# Altium schematic sheet Sheet1.SchDoc
size A4; SheetNumber: 1; SheetTotal: 1
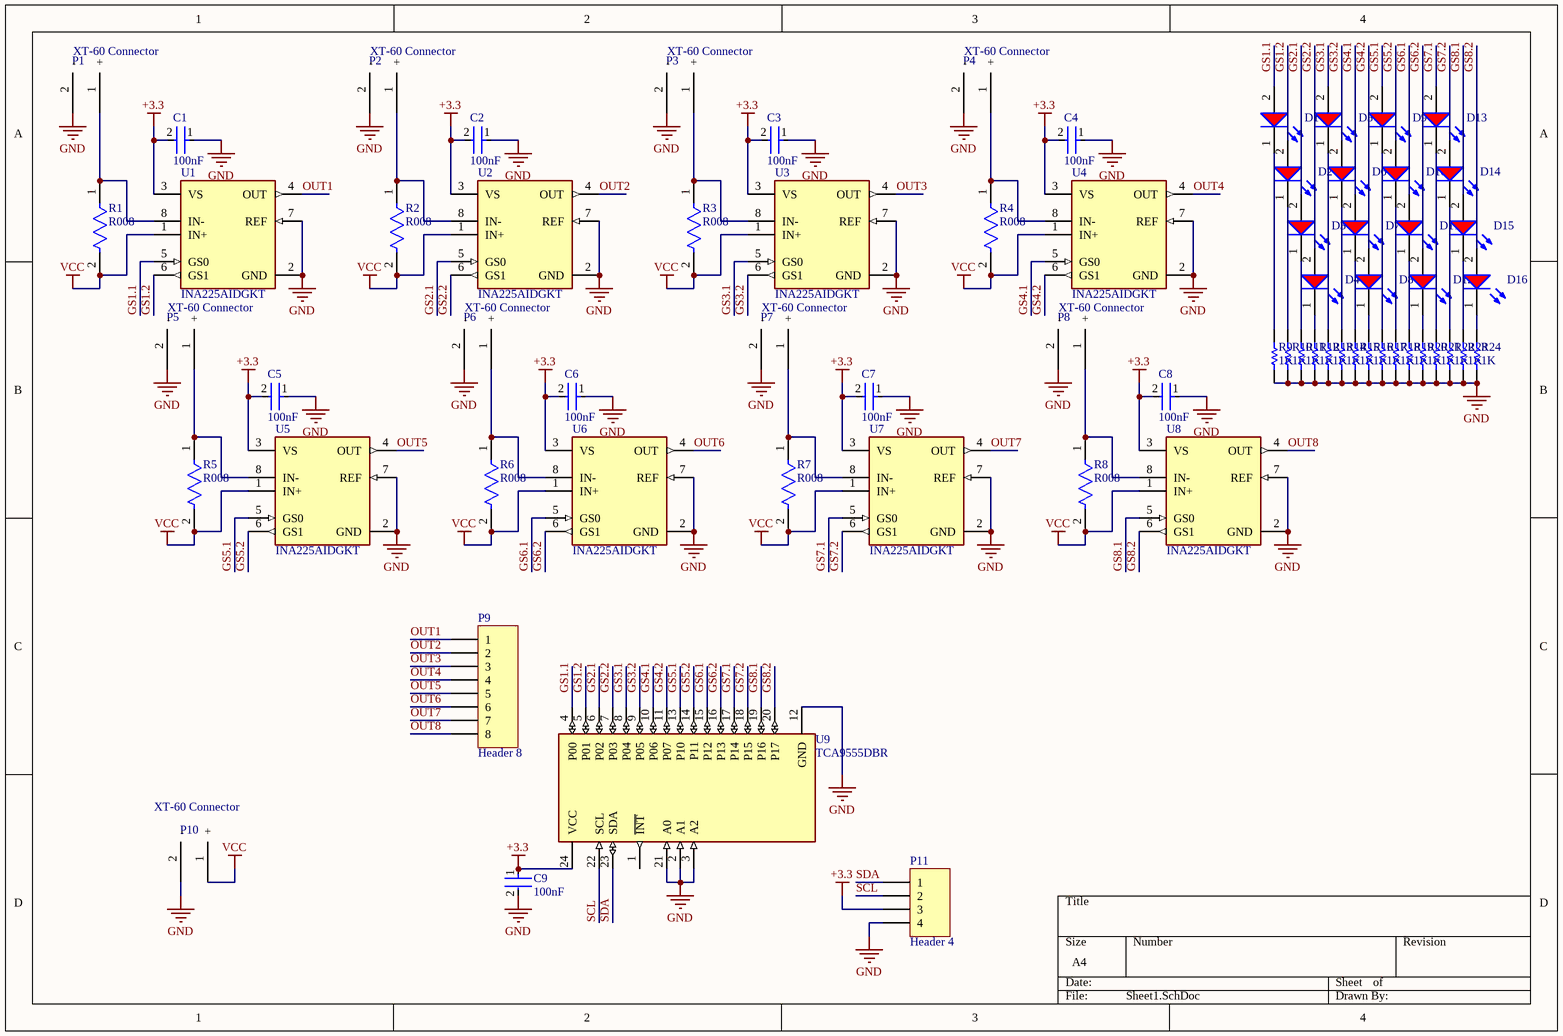
[diagram p0: Sheet1.SchDoc]

## Parts
C1  100nF  [FP-0805-L_2_01_0_2-W_1_25-IPC_B]
C2  100nF  [FP-0805-L_2_01_0_2-W_1_25-IPC_B]
C3  100nF  [FP-0805-L_2_01_0_2-W_1_25-IPC_B]
C4  100nF  [FP-0805-L_2_01_0_2-W_1_25-IPC_B]
C5  100nF  [FP-0805-L_2_01_0_2-W_1_25-IPC_B]
C6  100nF  [FP-0805-L_2_01_0_2-W_1_25-IPC_B]
C7  100nF  [FP-0805-L_2_01_0_2-W_1_25-IPC_B]
C8  100nF  [FP-0805-L_2_01_0_2-W_1_25-IPC_B]
C9  100nF  [FP-0805-L_2_01_0_2-W_1_25-IPC_B]
D1  150080SS75000  [WL-SMCW_0805_150080xx75000]  (value not drawn)
D2  150080SS75000  [WL-SMCW_0805_150080xx75000]  (value not drawn)
D3  150080SS75000  [WL-SMCW_0805_150080xx75000]  (value not drawn)
D4  150080SS75000  [WL-SMCW_0805_150080xx75000]  (value not drawn)
D5  150080SS75000  [WL-SMCW_0805_150080xx75000]  (value not drawn)
D6  150080SS75000  [WL-SMCW_0805_150080xx75000]  (value not drawn)
D7  150080SS75000  [WL-SMCW_0805_150080xx75000]  (value not drawn)
D8  150080SS75000  [WL-SMCW_0805_150080xx75000]  (value not drawn)
D9  150080SS75000  [WL-SMCW_0805_150080xx75000]  (value not drawn)
D10  150080SS75000  [WL-SMCW_0805_150080xx75000]  (value not drawn)
D11  150080SS75000  [WL-SMCW_0805_150080xx75000]  (value not drawn)
D12  150080SS75000  [WL-SMCW_0805_150080xx75000]  (value not drawn)
D13  150080SS75000  [WL-SMCW_0805_150080xx75000]  (value not drawn)
D14  150080SS75000  [WL-SMCW_0805_150080xx75000]  (value not drawn)
D15  150080SS75000  [WL-SMCW_0805_150080xx75000]  (value not drawn)
D16  150080SS75000  [WL-SMCW_0805_150080xx75000]  (value not drawn)
P1  XT-60 Connector  [2]
P2  XT-60 Connector  [2]
P3  XT-60 Connector  [2]
P4  XT-60 Connector  [2]
P5  XT-60 Connector  [2]
P6  XT-60 Connector  [2]
P7  XT-60 Connector  [2]
P8  XT-60 Connector  [2]
P9  Header 8  [HDR1X8]
P10  XT-60 Connector  [2]
P11  Header 4  [HDR1X4]
R1  R008  [FP-RL2512-MFG]
R2  R008  [FP-RL2512-MFG]
R3  R008  [FP-RL2512-MFG]
R4  R008  [FP-RL2512-MFG]
R5  R008  [FP-RL2512-MFG]
R6  R008  [FP-RL2512-MFG]
R7  R008  [FP-RL2512-MFG]
R8  R008  [FP-RL2512-MFG]
R9  1K  [RESC2013X60X35ML10T20]
R10  1K  [RESC2013X60X35ML10T20]
R11  1K  [RESC2013X60X35ML10T20]
R12  1K  [RESC2013X60X35ML10T20]
R13  1K  [RESC2013X60X35ML10T20]
R14  1K  [RESC2013X60X35ML10T20]
R15  1K  [RESC2013X60X35ML10T20]
R16  1K  [RESC2013X60X35ML10T20]
R17  1K  [RESC2013X60X35ML10T20]
R18  1K  [RESC2013X60X35ML10T20]
R19  1K  [RESC2013X60X35ML10T20]
R20  1K  [RESC2013X60X35ML10T20]
R21  1K  [RESC2013X60X35ML10T20]
R22  1K  [RESC2013X60X35ML10T20]
R23  1K  [RESC2013X60X35ML10T20]
R24  1K  [RESC2013X60X35ML10T20]
U1  INA225AIDGKT  [FP-INA225AIDGKT-IPC_A]
U2  INA225AIDGKT  [FP-INA225AIDGKT-IPC_A]
U3  INA225AIDGKT  [FP-INA225AIDGKT-IPC_A]
U4  INA225AIDGKT  [FP-INA225AIDGKT-IPC_A]
U5  INA225AIDGKT  [FP-INA225AIDGKT-IPC_A]
U6  INA225AIDGKT  [FP-INA225AIDGKT-IPC_A]
U7  INA225AIDGKT  [FP-INA225AIDGKT-IPC_A]
U8  INA225AIDGKT  [FP-INA225AIDGKT-IPC_A]
U9  TCA9555DBR  [FP-DB0024A-IPC_A]

## Nets
+3.3: C1.2 C2.2 C3.2 C4.2 C5.2 C6.2 C7.2 C8.2 C9.1 P11.3 U1.3(VS) U2.3(VS) U3.3(VS) U4.3(VS) U5.3(VS) U6.3(VS) U7.3(VS) U8.3(VS) U9.24(VCC)
GND: C1.1 C2.1 C3.1 C4.1 C5.1 C6.1 C7.1 C8.1 C9.2 P1.2(-) P2.2(-) P3.2(-) P4.2(-) P5.2(-) P6.2(-) P7.2(-) P8.2(-) P10.2(-) P11.4 R9.1 R10.1 R11.1 R12.1 R13.1 R14.1 R15.1 R16.1 R17.1 R18.1 R19.1 R20.1 R21.1 R22.1 R23.1 R24.1 U1.2(GND) U1.7(REF) U2.2(GND) U2.7(REF) U3.2(GND) U3.7(REF) U4.2(GND) U4.7(REF) U5.2(GND) U5.7(REF) U6.2(GND) U6.7(REF) U7.2(GND) U7.7(REF) U8.2(GND) U8.7(REF) U9.2(A1) U9.3(A2) U9.12(GND) U9.21(A0)
VCC: P10.1(+) R1.2 R2.2 R3.2 R4.2 R5.2 R6.2 R7.2 R8.2 U1.1(IN+) U2.1(IN+) U3.1(IN+) U4.1(IN+) U5.1(IN+) U6.1(IN+) U7.1(IN+) U8.1(IN+)
GS1.1: D1.2(A) U1.5(GS0) U9.4(P00)
GS1.2: D2.2(A) U1.6(GS1) U9.5(P01)
GS2.1: D3.2(A) U2.5(GS0) U9.6(P02)
GS2.2: D4.2(A) U2.6(GS1) U9.7(P03)
GS3.1: D5.2(A) U3.5(GS0) U9.8(P04)
GS3.2: D6.2(A) U3.6(GS1) U9.9(P05)
GS4.1: D7.2(A) U4.5(GS0) U9.10(P06)
GS4.2: D8.2(A) U4.6(GS1) U9.11(P07)
GS5.1: D9.2(A) U5.5(GS0) U9.13(P10)
GS5.2: D10.2(A) U5.6(GS1) U9.14(P11)
GS6.1: D11.2(A) U6.5(GS0) U9.15(P12)
GS6.2: D12.2(A) U6.6(GS1) U9.16(P13)
GS7.1: D13.2(A) U7.5(GS0) U9.17(P14)
GS7.2: D14.2(A) U7.6(GS1) U9.18(P15)
GS8.1: D15.2(A) U8.5(GS0) U9.19(P16)
GS8.2: D16.2(A) U8.6(GS1) U9.20(P17)
OUT1: P9.1 U1.4(OUT)
OUT2: P9.2 U2.4(OUT)
OUT3: P9.3 U3.4(OUT)
OUT4: P9.4 U4.4(OUT)
OUT5: P9.5 U5.4(OUT)
OUT6: P9.6 U6.4(OUT)
OUT7: P9.7 U7.4(OUT)
OUT8: P9.8 U8.4(OUT)
SCL: P11.2 U9.22(SCL)
SDA: P11.1 U9.23(SDA)
NetD1_1: D1.1(K) R9.2
NetD2_1: D2.1(K) R10.2
NetD3_1: D3.1(K) R11.2
NetD4_1: D4.1(K) R12.2
NetD5_1: D5.1(K) R13.2
NetD6_1: D6.1(K) R14.2
NetD7_1: D7.1(K) R15.2
NetD8_1: D8.1(K) R16.2
NetD9_1: D9.1(K) R17.2
NetD10_1: D10.1(K) R18.2
NetD11_1: D11.1(K) R19.2
NetD12_1: D12.1(K) R20.2
NetD13_1: D13.1(K) R21.2
NetD14_1: D14.1(K) R22.2
NetD15_1: D15.1(K) R23.2
NetD16_1: D16.1(K) R24.2
NetP1_1: P1.1(+) R1.1 U1.8(IN-)
NetP2_1: P2.1(+) R2.1 U2.8(IN-)
NetP3_1: P3.1(+) R3.1 U3.8(IN-)
NetP4_1: P4.1(+) R4.1 U4.8(IN-)
NetP5_1: P5.1(+) R5.1 U5.8(IN-)
NetP6_1: P6.1(+) R6.1 U6.8(IN-)
NetP7_1: P7.1(+) R7.1 U7.8(IN-)
NetP8_1: P8.1(+) R8.1 U8.8(IN-)

Not connected (* = marked no-connect by the designer): U9 1(~{INT})

## Library data of the parts
C1-C9 = CMP-2007-04174-2: General Purpose Ceramic Capacitor, 0805, 100nF, 10%, X7R, 15%, 100V; Packaging: Tape and Reel; Min Operating Temperature: -55°C; Dielectric Material: Ceramic; Height: 1.4mm; Voltage Rating: 100V; Termination: SMD/SMT; Case Code (Imperial): 0805; Case Code (Metric): 2012; Case/Package: 0805; Construction: Flat; Radiation Hardening: No; Series: -; Dielectric: X7R; Package Quantity: 2000; Mount: Surface Mount; Capacitance: 100nF; Contact Plating: Tin; Voltage: 100V; Lead Free: Lead Free; Depth: 1.25mm; RoHS Compliant: Yes; Number of Pins: 2; Max Operating Temperature: 125°C; Length: 2.01mm; Voltage Rating (DC): 100V; Thickness: 0.055inch; REACH SVHC: No SVHC; Width: 0.049inch; Tolerance: 10%
D1-D16 = CMP-1426-00010-3: NexarPartId: 29717782; Peak Wavelength: 645nm; Luminous Intensity: 60mcd; Max Junction Temperature (Tj): 95°C; Wavelength: 630nm; Forward Current: 100mA; Max Reverse Voltage (DC): 5V; Color: Red; Lens Style: Clear, Rectangular; Test Current: 20mA; Power Dissipation: 72mW; Viewing Angle: 140°; Forward Voltage: 1.9V; Case Code (Metric): 2012; Max Operating Temperature: 85°C; Mount: Surface Mount; Height: 700µm; Case/Package: 0805; Min Operating Temperature: -40°C; Reverse Voltage: 5V; RoHS: Compliant; Packaging: Tape and Reel; REACH SVHC: Unknown; Case Code (Imperial): 0805; Length: 2mm; Width: 1.25mm; Dominant Wavelength: 630nm
P1-P8 P10 = XT-60 Connector: Manufacturer: POLOLU; Manufacturer Part Number: XT60 YELLOW; Unit: pcs; SuppliedAmount: 0; MinAmount: 1; Type of robotics accessories: power connector; Maximum current: 65A; Information: Product is not a working device, but only component; Supplier 1: TME; Category: Power Supply Modules; Stock 1: 29; Pricing 1: 1=2.08, 10=1.95 (USD); Weight: 7.267; Multiples: 1; Number of pins: 2; Colour: yellow; Price Type: NET; ComponentLink1URL: http://static.tme.eu/products_pics/8/b/5/8b5040a8a5baf3e0e67386c2e3a9b903/913.jpg; ComponentLink1Description: http://static.tme.eu/products_pics/8/b/5/8b5040a8a5baf3e0e67386c2e3a9b903/913.jpg; Supplier Part Number 1: XT-60 Connector
P9 = Header 8: Header, 8-Pin; LatestRevisionDate: 17-Jul-2002; LatestRevisionNote: Re-released for DXP Platform.; Publisher: Altium Limited
P11 = Header 4: Header, 4-Pin; LatestRevisionDate: 17-Jul-2002; LatestRevisionNote: Re-released for DXP Platform.; Publisher: Altium Limited
R1-R8 = CMP-03412-013102-1: RES 0.1 OHM 1% 1W 2512; Manufacturer: YAGEO; Manufacturer Part Number: RL2512FK-070R1L; Automotive Grade: Grade 0; Temperature Coefficient: 600ppm/°C; Value: 100mΩ; Lead Free: Yes; Package: RL2512; Temperature Range High: +155°C; Octopart: https://octopart.com/rl2512fk-070r1l-yageo-42334369; Composition: Thick Film; Height: 0.65mm; ComponentLink2URL: http://www.yageo.com/documents/recent/PYu-RL_Group_521_RoHS_L_2.pdf; Device Class L3: Chip SMD Resistors; Automotive: Yes; Series: RL; Device Class L1: Passive Components; Device Class L2: Resistors; Mouser Description: Current Sense Resistors 0.1ohm 1% 1W; Temperature: -55°C to +155°C; ComponentLink2Description: Datasheet; Footprint Url: http://www.yageo.com/exep/pages/download/literatures/PYu-R_Mount_10.pdf; Ipc Land Pattern Name: RESC635320X55; RoHS: TRUE; Category: Res; Temperature Range Low: -55°C; Power Rating: 1W; Tolerance: 1%; Resistance: 100mΩ; Digikey Description: RES 0.1 OHM 1% 1W 2512
R9-R24 = CMP-2100-03671-1: Chip Resistor, 1 KOhm, +/- 1%, 125 mW, -55 to 155 degC, 0805 (2012 Metric), RoHS, Tape and Reel; Manufacturer: Yageo; Temperature Coefficient: 100ppm/degreesC; Voltage Rating (DC): 150V; Max Power Dissipation: 125mW; Resistance: 1KOhm; Number of Pins: 2; Number of Terminations: 2; Datasheet URL: http://www.yageo.com/NewPortal/yageodocoutput?fileName=/pdf/R-Chip/PYu-RC_Group_51_RoHS_L_5.pdf; Length: 0.079inch; Package Description: 2-Pin Surface Mounted Device, Body 2 x 1.25 mm; Depth: 1.25mm; Height: 0.024inch; Military Standard: Not; Case/Package: 0805; Package Reference: 0805; RoHSCompliant: true; Lead Free: LeadFree; Packaging: TapeandReel; Package Quantity: 1; Datasheet Version: Rev. 5, 10/2016; Tolerance: 1%; Min Operating Temperature: -55degC; Voltage Rating: 150V; Composition: ThickFilm; Case Code (Imperial): 0805; Power Rating: 125mW; Width: 0.049inch; Case Code (Metric): 2012; Manufacturer URL: http://www.yageo.com/; Max Operating Temperature: 155degC; REACH SVHC: Unknown; Termination: SMD/SMT
U1-U8 = CMP-04895-000038-1: IC MONITOR PWR/CUR BIDIR 8VSSOP; Manufacturer: Texas Instruments; Nominal Supply Current: 300uA; Input Bias Current: 72uA; Bandwidth: 250kHz; Number Of Channels: 1; Voltage Gain: 0.025/0.05/0.1/0.2V/mV; Standoff Height: 0.05mm; Min Supply Voltage: 2.7V; Input Offset Voltage: 0.075mV; Max Junction Temp: +150°C; Max Supply Voltage: 36V; Ipc Land Pattern Name: SOIC65P490X110-8; Device Class L2: Linear ICs; Automotive: No; Ambient Temperature Range Low: -40°C; Octopart: https://octopart.com/ina225aidgkt-texas+instruments-28946314; Ambient Temperature Range High: +125°C; RoHS: TRUE; Height: 1.1mm; Temperature Range High: +125°C; Package: VSSOP8; Temperature Range Low: -40°C; Temperature: -40°C to +125°C; Lead Free: Yes; Digikey Description: IC MONITOR PWR/CUR BIDIR 8VSSOP; Device Class L1: Integrated Circuits (ICs); Mouser Description: Current Sense Amplifiers 36V Bidir 0-Drift Ser Crnt-Shunt Mon; Device Class L3: Instrumentation; Manufacturer Part Number: INA225AIDGKT; Category: IC; ComponentLink2Description: Datasheet; ComponentLink2URL: http://www.ti.com/lit/ds/symlink/ina225.pdf
U9 = CMP-04886-000014-1: IC I/O EXPANDER 16B 24SSOP; Interface: I2C; Max Supply Voltage: 5.5V; Number of I/Os: 16; Min Supply Voltage: 1.65V; RoHS Compliant: Yes; Case/Package: SSOP; Min Operating Temperature: -40°C; Packaging: Cut Tape; Max Operating Temperature: 85°C; Lead Free: Lead Free; Number of Pins: 24